# Altium project pcb1.PrjPcb
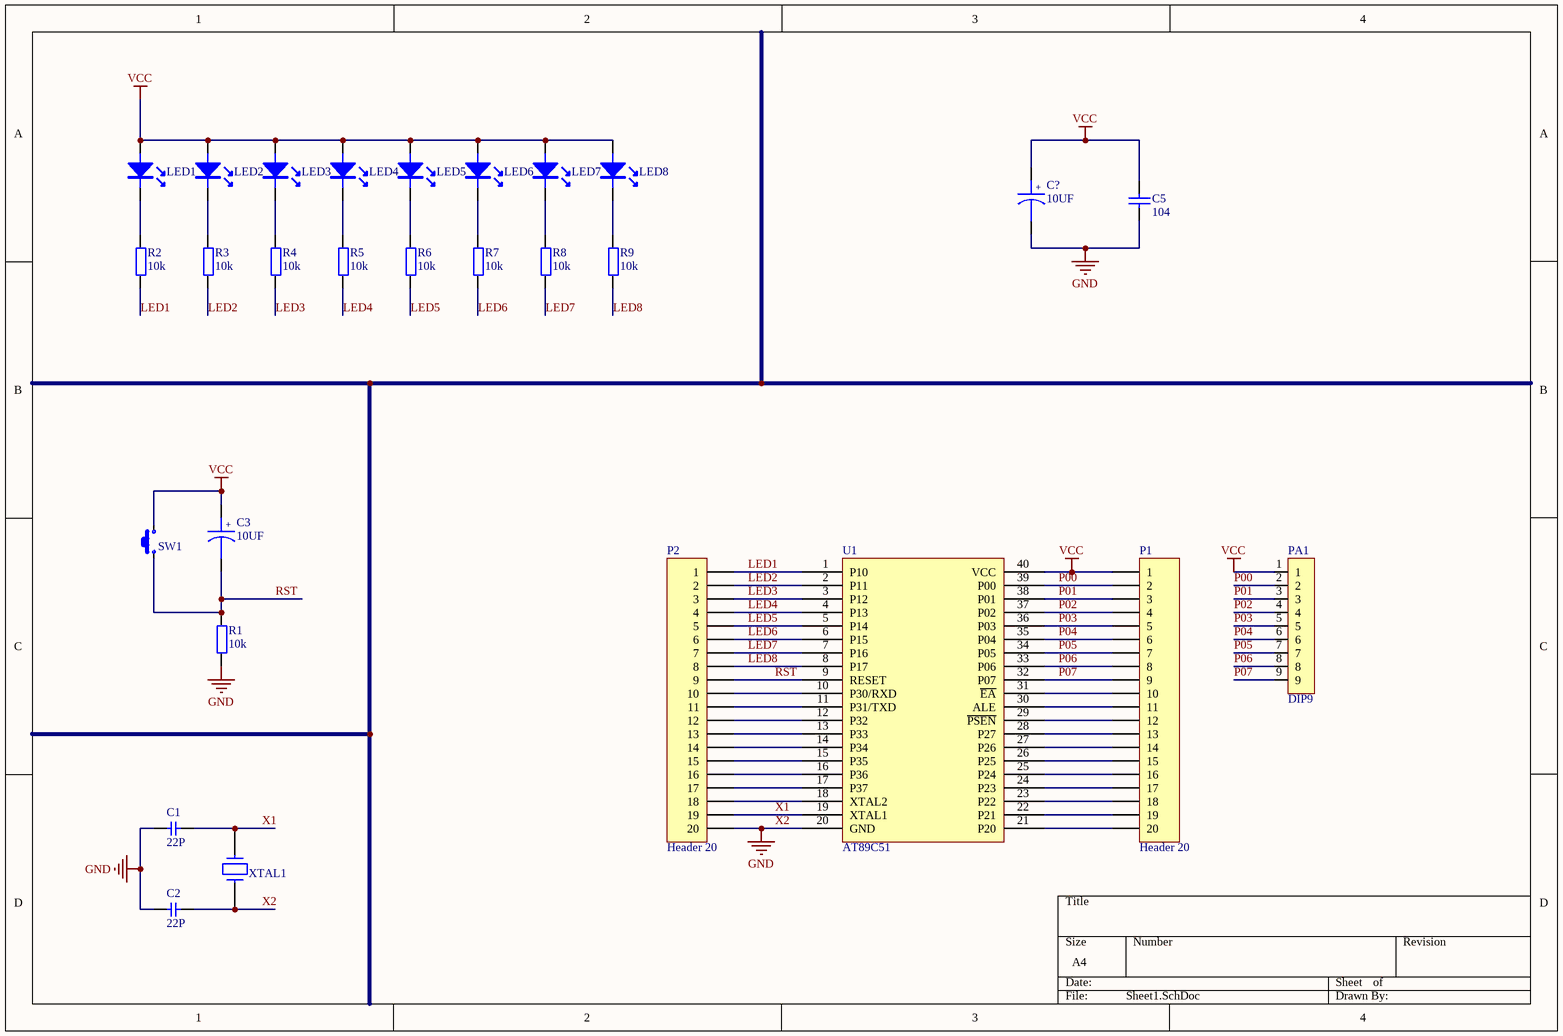
[diagram p0: Sheet1.SchDoc]
1 sheet, 28 parts. Net scope: global (net labels, ports and power ports of the same name join across sheets).
Board file: PCB1.PcbDoc

## Sheet Sheet1.SchDoc
size A4

### Parts
C1  22  [0805C]  (value not drawn)
C2  22  [0805C]  (value not drawn)
C3  CAPD  [RB470U]  (value not drawn)
C4  CAPD  [RB470U]  (value not drawn)
C5  value 104  [0805C]  (hidden comment: Cap Semi)
LED1  LED  [0805-LED]  (value not drawn)
LED2  LED  [0805-LED]  (value not drawn)
LED3  LED  [0805-LED]  (value not drawn)
LED4  LED  [0805-LED]  (value not drawn)
LED5  LED  [0805-LED]  (value not drawn)
LED6  LED  [0805-LED]  (value not drawn)
LED7  LED  [0805-LED]  (value not drawn)
LED8  LED  [0805-LED]  (value not drawn)
P1  Header 20  [HDR1X20]
P2  Header 20  [HDR1X20]
PA1  DIP9  [DIP9]
R1  10k  [0805]
R2  10k  [0805]
R3  10k  [0805]
R4  10k  [0805]
R5  10k  [0805]
R6  10k  [0805]
R7  10k  [0805]
R8  10k  [0805]
R9  10k  [0805]
SW1  SW  [SWD]  (value not drawn)
U1  AT89C51  [DIP40紧锁座]
XTAL1  CRYSTAL  [XTAL]  (value not drawn)

### Nets
VCC: C3.1 C4.1 C5.2 LED1.1 LED2.1 LED3.1 LED4.1 LED5.1 LED6.1 LED7.1 LED8.1 P1.1 PA1.1 SW1.2 U1.40(VCC)
X2: C1.1 C2.1 C2.2 C4.2 C5.1 P2.20 R1.1 U1.20(GND) XTAL1.1  [also labelled GND]
LED1: P2.1 R2.1 U1.1(P10)
LED2: P2.2 R3.1 U1.2(P11)
LED3: P2.3 R4.1 U1.3(P12)
LED4: P2.4 R5.1 U1.4(P13)
LED5: P2.5 R6.1 U1.5(P14)
LED6: P2.6 R7.1 U1.6(P15)
LED7: P2.7 R8.1 U1.7(P16)
LED8: P2.8 R9.1 U1.8(P17)
P00: P1.2 PA1.2 U1.39(P00)
P01: P1.3 PA1.3 U1.38(P01)
P02: P1.4 PA1.4 U1.37(P02)
P03: P1.5 PA1.5 U1.36(P03)
P04: P1.6 PA1.6 U1.35(P04)
P05: P1.7 PA1.7 U1.34(P05)
P06: P1.8 PA1.8 U1.33(P06)
P07: P1.9 PA1.9 U1.32(P07)
RST: C3.2 P2.9 R1.2 SW1.1 U1.9(RESET)
X1: C1.2 P2.19 U1.19(XTAL1) XTAL1.2
NetLED1_2: LED1.2 R2.2
NetLED2_2: LED2.2 R3.2
NetLED3_2: LED3.2 R4.2
NetLED4_2: LED4.2 R5.2
NetLED5_2: LED5.2 R6.2
NetLED6_2: LED6.2 R7.2
NetLED7_2: LED7.2 R8.2
NetLED8_2: LED8.2 R9.2
NetP1_10: P1.10 U1.31(~{EA})
NetP1_11: P1.11 U1.30(ALE)
NetP1_12: P1.12 U1.29(~{PSEN})
NetP1_13: P1.13 U1.28(P27)
NetP1_14: P1.14 U1.27(P26)
NetP1_15: P1.15 U1.26(P25)
NetP1_16: P1.16 U1.25(P24)
NetP1_17: P1.17 U1.24(P23)
NetP1_18: P1.18 U1.23(P22)
NetP1_19: P1.19 U1.22(P21)
NetP1_20: P1.20 U1.21(P20)
NetP2_10: P2.10 U1.10(P30/RXD)
NetP2_11: P2.11 U1.11(P31/TXD)
NetP2_12: P2.12 U1.12(P32)
NetP2_13: P2.13 U1.13(P33)
NetP2_14: P2.14 U1.14(P34)
NetP2_15: P2.15 U1.15(P35)
NetP2_16: P2.16 U1.16(P36)
NetP2_17: P2.17 U1.17(P37)
NetP2_18: P2.18 U1.18(XTAL2)

### Notes on the sheet
- (in symbol CAP) 22P
- (in symbol CAPD) +; 10UF

### Library data of the parts
C1 C2 = CAP: C
C5 = Cap Semi: Capacitor (Semiconductor SIM Model); Published: 8-Jun-2000; LatestRevisionDate: 17-Jul-2002; LatestRevisionNote: Re-released for DXP Platform.; PackageReference: C1206; Publisher: Altium Limited
P1 P2 = Header 20: Header, 20-Pin; LatestRevisionDate: 17-Jul-2002; LatestRevisionNote: Re-released for DXP Platform.; Publisher: Altium Limited
R1-R9 = R1: R?